# Altium project GUAU.PrjPcb
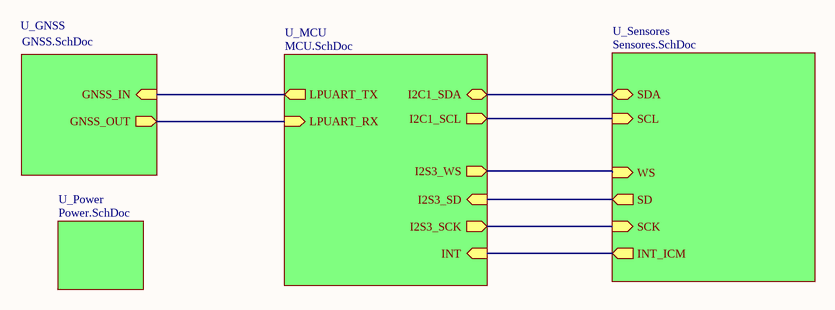
[diagram p0: Main.SchDoc]
5 sheets, 48 parts. Net scope: hierarchical (ports join the sheet entries above them; power ports are global).
Board file: GUAU.PcbDoc
Sheets:
  Main.SchDoc
    U_Power = Power.SchDoc
    U_MCU = MCU.SchDoc
    U_GNSS = GNSS.SchDoc
    U_Sensores = Sensores.SchDoc

## Sheet Main.SchDoc: GUAU
size A4; Date: *******; ApprovedBy: *******; CheckedBy: Alberte Gil; Author: *******; CompanyName: *******; DrawnBy: Mario de Miguel; Engineer: *******; Organization: *******; Address1: *******; Address2: *******; Address3: *******; Address4: *******; DocumentNumber: 1; Revision: *******; SheetNumber: 1; SheetTotal: 5; CurrentTime: *******; CurrentDate: *******; Time: *******; DocumentFullPathAndName: *******; DocumentName: *******; ModifiedDate: *******; ImagePath: *******; ProjectName: *******; Application_BuildNumber: *******

### Sub-sheets
U_GNSS = GNSS.SchDoc: GNSS_IN (in), GNSS_OUT (out)
U_MCU = MCU.SchDoc: LPUART_RX (in), LPUART_TX (out), I2C1_SDA (bidir), I2C1_SCL (out), I2S3_WS (out), I2S3_SD (in), I2S3_SCK (out), INT (in)
U_Power = Power.SchDoc: no entries
U_Sensores = Sensores.SchDoc: SDA (bidir), SCL (in), SCK (in), SD (out), INT_ICM (out), WS (in)

### Nets
SCK: sheet U_MCU/I2S3_SCK, sheet U_Sensores/SCK
SCL: sheet U_MCU/I2C1_SCL, sheet U_Sensores/SCL
SD: sheet U_MCU/I2S3_SD, sheet U_Sensores/SD
SDA: sheet U_MCU/I2C1_SDA, sheet U_Sensores/SDA
WS: sheet U_MCU/I2S3_WS, sheet U_Sensores/WS
NetU2_23: sheet U_MCU/INT, sheet U_Sensores/INT_ICM
NetU2_30: sheet U_MCU/LPUART_RX, sheet U_GNSS/GNSS_OUT
NetU2_31: sheet U_MCU/LPUART_TX, sheet U_GNSS/GNSS_IN

### Notes on the sheet
- Title:
- Drawn By:
- Page Contents:
- Checked By:
- Size:
- Date:
- File:
- License:
- Email:
- A4
- Number:
- Time:
- Revision:
- Sheet
- Website:
- of

## Sheet Power.SchDoc: Alimentación
size A4; Date: *******; ApprovedBy: *******; CheckedBy: Mario de Miguel; Author: *******; CompanyName: *******; DrawnBy: Alberte Gil; Engineer: *******; Organization: *******; Address1: *******; Address2: *******; Address3: *******; Address4: *******; DocumentNumber: 2; Revision: *******; SheetNumber: 2; SheetTotal: 5; CurrentTime: *******; CurrentDate: *******; Time: *******; DocumentFullPathAndName: *******; DocumentName: *******; ModifiedDate: *******; ImagePath: *******; ProjectName: *******; Application_BuildNumber: *******
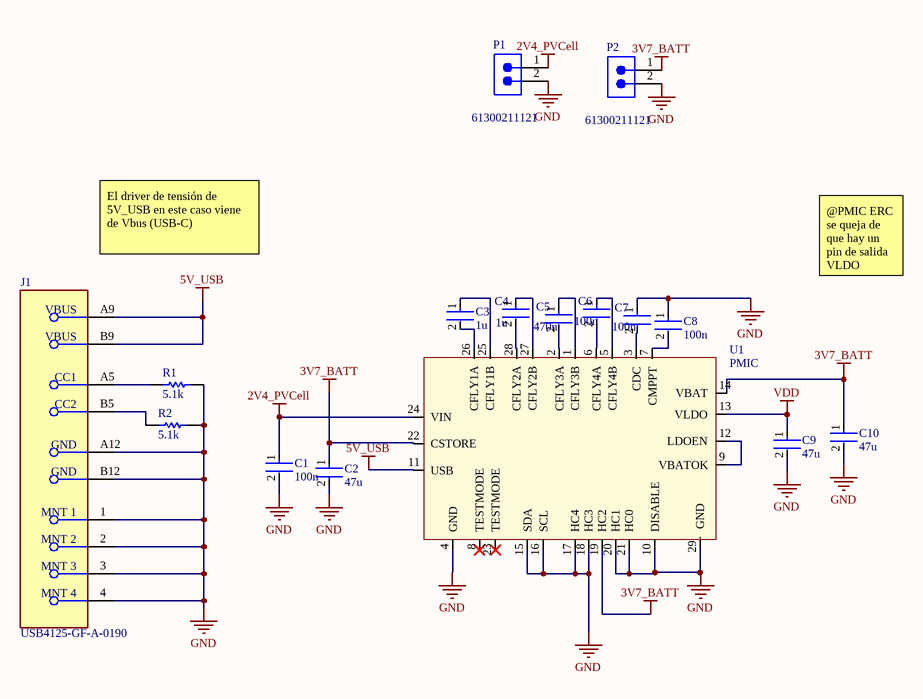
[diagram p1: Power.SchDoc]

### Parts
C1  100n  [FP-GRM033-0_03-MFG]
C2  47u  [FP-GRM188-0_2-IPC_B]
C3  1u  [FP-GRM033-0_05-e01_0_2-IPC_B]
C4  1u  [FP-GRM033-0_05-e01_0_2-IPC_B]
C5  470n  [FP-GRM033-0_03-IPC_C]
C6  100n  [FP-GRM033-0_03-MFG]
C7  100n  [FP-GRM033-0_03-MFG]
C8  100n  [FP-GRM033-0_03-MFG]
C9  47u  [FP-GRM188-0_2-IPC_B]
C10  47u  [FP-GRM188-0_2-IPC_B]
J1  USB4125-GF-A-0190  [FP-USB4125-GF-A-0190-MFG]
P1  61300211121  [61300211121]
P2  61300211121  [61300211121]
R1  5.1k  [RESC1608X55X25ML10T15]
R2  5.1k  [RESC1608X55X25ML10T15]
U1  PMIC  [HVQFN-28]

### Nets
2V4_PVCell: C1.1 P1.1 U1.24(VIN)
3V7_BATT: C2.1 C10.1 P2.1 U1.14(VBAT) U1.19(HC2) U1.22(CSTORE)
5V_USB: J1.A9(VBUS) J1.B9(VBUS) U1.11(USB)
GND: C1.2 C2.2 C7.1 C8.1 C9.2 C10.2 J1.1(MNT_1) J1.2(MNT_2) J1.3(MNT_3) J1.4(MNT_4) J1.A12(GND) J1.B12(GND) P1.2 P2.2 R1.2 R2.2 U1.4(GND) U1.10(DISABLE) U1.15(SDA) U1.16(SCL) U1.17(HC4) U1.18(HC3) U1.21(HC0) U1.29(GND)
VDD: C9.1 U1.13(VLDO)
NetC3_1: C3.1 U1.25(CFLY1B)
NetC3_2: C3.2 U1.26(CFLY1A)
NetC4_1: C4.1 U1.27(CFLY2B)
NetC4_2: C4.2 U1.28(CFLY2A)
NetC5_1: C5.1 U1.1(CFLY3B)
NetC5_2: C5.2 U1.2(CFLY3A)
NetC6_1: C6.1 U1.5(CFLY4B)
NetC6_2: C6.2 U1.6(CFLY4A)
NetC7_2: C7.2 U1.3(CDC)
NetC8_2: C8.2 U1.7(CMPPT)
NetJ1_A5: J1.A5(CC1) R1.1
NetJ1_B5: J1.B5(CC2) R2.1
NetU1_9: U1.9(VBATOK) U1.12(LDOEN)

Not connected (* = marked no-connect by the designer): U1 8(TESTMODE)* 20(HC1) 23(TESTMODE)*

### Notes on the sheet
- El driver de tensión de 5V_USB en este caso viene de Vbus (USB-C)
- @PMIC ERC se queja de que hay un pin de salida VLDO enchufado a la VDD de todo el circuito
- Title:
- Drawn By:
- Page Contents:
- Checked By:
- Size:
- Date:
- File:
- License:
- Email:
- A4
- Number:
- Time:
- Revision:
- Sheet
- Website:
- of

### Library data of the parts
C1 C6-C8 = CMP-06035-019037-1: Chip Multilayer Ceramic Capacitors for General Purpose, 0201, 0.10uF, X7S, 22%, 10%, 16V; Capacitance: 100nF; Dielectric: X7S; Tolerance: 10%; Voltage Rating (DC): 16V; Height: 0.3mm; Max Operating Temperature: 125°C; Case Code (Metric): 0603; Termination: SMD/SMT; Min Operating Temperature: -55°C; Mount: Surface Mount; Case/Package: 0201; Weight: 1.2E-05oz; Package Quantity: 15000; Length: 0.024inch; Voltage Rating: 16V; Case Code (Imperial): 0201; Packaging: Tape and Reel; Thickness: 0.013inch; Width: 0.3mm
C2 C9 C10 = CMP-2000-05444-2: Chip Multilayer Ceramic Capacitors for General Purpose, 0603, 47uF, X5R, 15%, 20%, 6.3V; Voltage Rating (DC): 6.3V; Thickness: 0.039inch; Case Code (Imperial): 0603; Packaging: Tape and Reel; Capacitance: 47uF; Width: 0.031inch; Dielectric: X5R; Max Operating Temperature: 85°C; Mount: Surface Mount; Case Code (Metric): 1608; Length: 0.063inch; Voltage Rating: 6.3V; Tolerance: 20%; Case/Package: 0603; Min Operating Temperature: -55°C
C3 C4 = CMP-06035-049033-1: Chip Multilayer Ceramic Capacitors for General Purpose, 0201, 1.0uF, X5R, 15%, 20%, 6.3V; Capacitance: 1uF; Max Operating Temperature: 85°C; Depth: 0.3mm; Case Code (Imperial): 0201; Voltage Rating (DC): 6.3V; Height: 0.3mm; Mount: Surface Mount; Weight: 1.2E-05oz; Packaging: Cut Tape; Dielectric: X5R; Width: 0.3mm; REACH SVHC: No SVHC; Package Quantity: 1; Case Code (Metric): 0603; Min Operating Temperature: -55°C; Case/Package: 0201; Tolerance: 20%; Thickness: 300um; Lead Free: Lead Free; Length: 0.6mm; Termination: SMD/SMT; Voltage: 6.3V; Voltage Rating: 6.3V
C5 = CMP-06035-010465-1: Chip Multilayer Ceramic Capacitors for General Purpose, 0201, 0.47uF, X5R, 15%, 10%, 6.3V; Capacitance: 470nF; Thickness: 0.013inch; Depth: 0.3mm; Height: 0.3mm; Mount: Surface Mount; Max Operating Temperature: 85°C; Tolerance: 10%; Dielectric: X5R; Length: 0.6mm; Package Quantity: 15000; Weight: 1.2E-05oz; Voltage Rating (DC): 6.3V; Lead Free: Lead Free; Termination: SMD/SMT; Voltage Rating: 6.3V; Case Code (Imperial): 0201; Width: 0.012inch; Case/Package: 0201; Case Code (Metric): 0603; Min Operating Temperature: -55°C; Packaging: Tape and Reel
J1 = CMP-245163-000004-1: CONN RCPT TYPE C 6P SMD RA
P1 P2 = CMP-1712-00002-6: NexarPartId: 20081794; Number of Contacts: 2; Pitch: 2.54mm; Connector Type: Male Pin; Voltage Rating: 250V; Current Rating: 3A; Gender: Male; Contact Resistance: 20mΩ; Height: 8.94mm; Lead Free: Lead Free; Number of Pins: 2; Termination: Through Hole; RoHS: Compliant; Lead Pitch: 2.54mm; REACH SVHC: No SVHC; Housing Material: PBT; Contact Mating Length: 5.9944mm; Min Operating Temperature: -40°C; Orientation: Vertical; Contact Material: Copper; Contact Gender: Male; Max Operating Temperature: 125°C; Number of Rows: 1; Number of Positions: 2; Packaging: Bulk; Contact Plating: Gold; Mount: Through Hole; Color: Black; Operating Supply Voltage: 250V
R1 R2 = CMP-2000-04091-1: Manufacturer: Yageo; Part Number: RC0603FR-075K1L
U1 = NEH7100BU: Power Management Specialised - PMIC Inductorless energy harvesting PMIC with battery protection, LDO and USB charging

## Sheet MCU.SchDoc: STM32WB05xZ
size A4; Date: *******; ApprovedBy: *******; CheckedBy: Alberte Gil; Author: *******; CompanyName: *******; DrawnBy: Mario de Miguel; Engineer: *******; Organization: *******; Address1: *******; Address2: *******; Address3: *******; Address4: *******; DocumentNumber: 3; Revision: *******; SheetNumber: 3; SheetTotal: 5; CurrentTime: *******; CurrentDate: *******; Time: *******; DocumentFullPathAndName: *******; DocumentName: *******; ModifiedDate: *******; ImagePath: *******; ProjectName: *******; Application_BuildNumber: *******
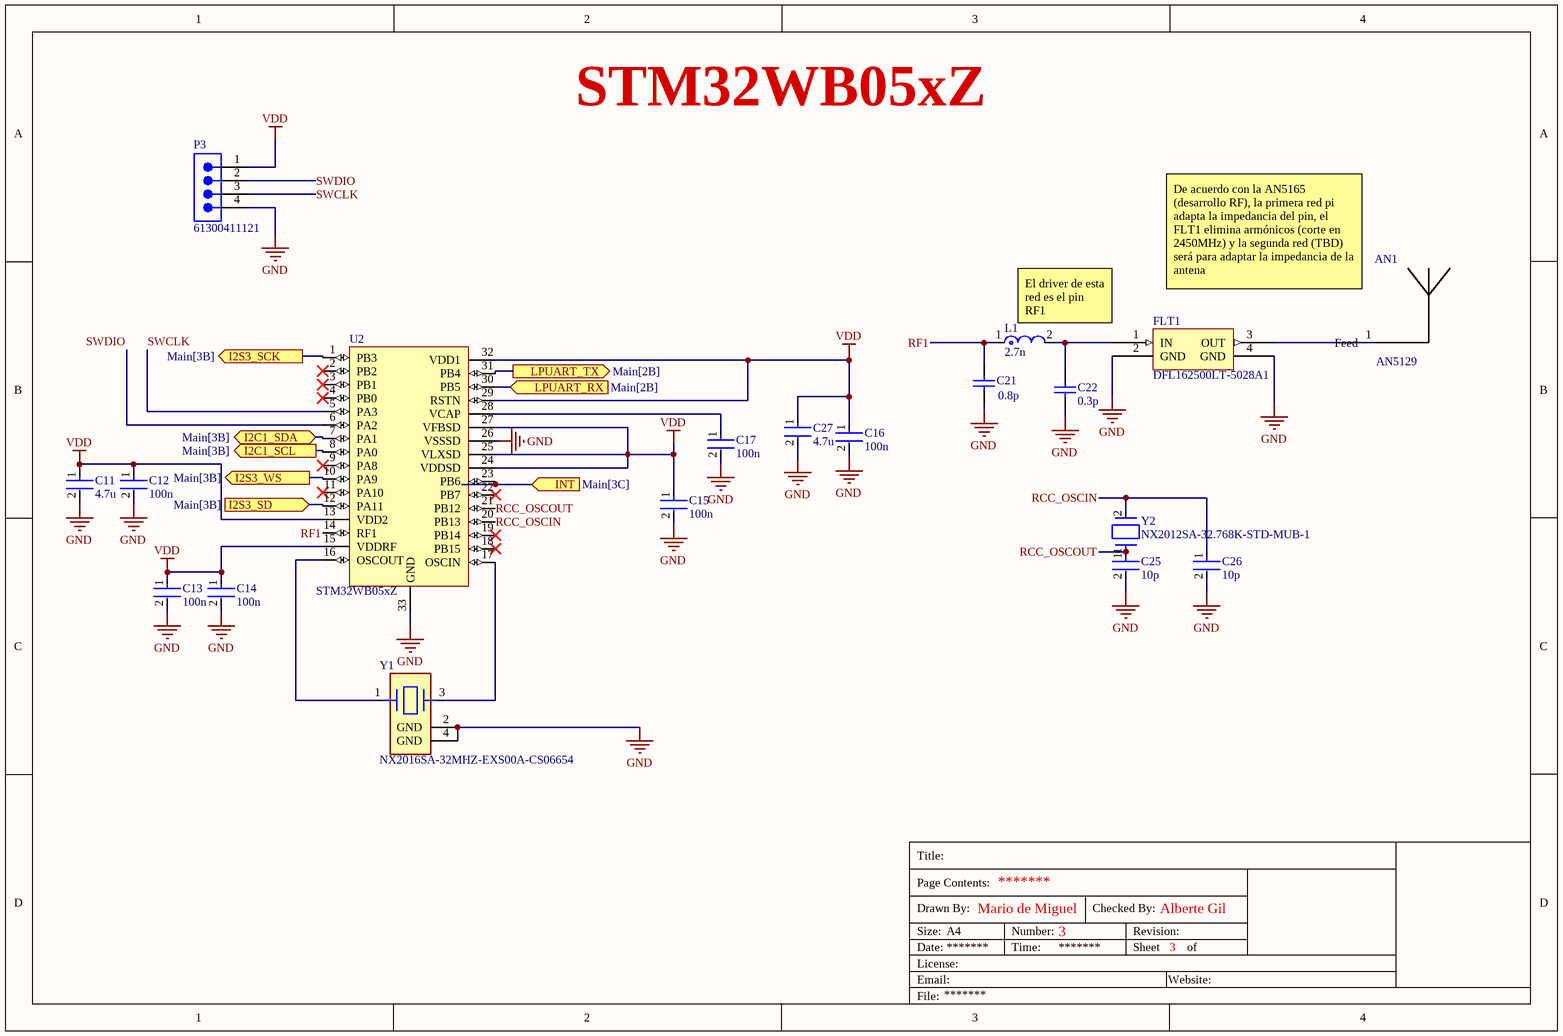
[diagram p2: MCU.SchDoc]

### Parts
AN1  AN5129  [AN5129]
C11  4.7u  [FP-GRM155-0_15-MFG]
C12  100n  [FP-GRM033-0_03-MFG]
C13  100n  [FP-GRM033-0_03-MFG]
C14  100n  [FP-GRM033-0_03-MFG]
C15  100n  [FP-GRM033-0_03-MFG]
C16  100n  [FP-GRM033-0_03-MFG]
C17  100n  [FP-GRM033-0_03-MFG]
C21  0.8p  [CAPC1005X55X25LL05T10]
C22  0.3p  [CAPC1005X55X25NL05T10]
C25  10p  [FP-GRM033-0_03-IPC_A]
C26  10p  [FP-GRM033-0_03-IPC_A]
C27  4.7u  [FP-GRM155-0_15-MFG]
FLT1  DFL162500LT-5028A1  [PCBComponent_1]
L1  2.7n  [FP-LQG15HH_02-IPC_C]
P3  61300411121  [61300411121]
U2  STM32WB05xZ  [STM32WB05XZ]
Y1  NX2016SA-32MHZ-EXS00A-CS06654  [FP-NX2016SA-MFG]
Y2  NX2012SA-32.768K-STD-MUB-1  [FP-NX2012SA-MFG]

### Ports
I2C1_SCL (out, see Main[3B]), I2C1_SDA (bidir, see Main[3B]), I2S3_SCK (out, see Main[3B]), I2S3_SD (in, see Main[3B]), I2S3_WS (out, see Main[3B]), INT (in, see Main[3C]), LPUART_RX (in, see Main[2B]), LPUART_TX (out, see Main[2B])

### Nets
GND: C11.2 C12.2 C13.2 C14.2 C15.2 C16.2 C17.2 C21.1 C22.1 C25.2 C26.2 C27.2 FLT1.2(GND) FLT1.4(GND) P3.4 U2.26(VSSSD) U2.33(GND) Y1.2(GND) Y1.4(GND)
VDD: C11.1 C12.1 C13.1 C14.1 C15.1 C16.1 C27.1 P3.1 U2.13(VDD2) U2.15(VDDRF) U2.24(VDDSD) U2.25(VLXSD) U2.27(VFBSD) U2.29(RSTN) U2.32(VDD1)
RCC_OSCIN: C26.1 U2.20(PB13) Y2.2
RCC_OSCOUT: C25.1 U2.21(PB12) Y2.1
RF1: C21.2 L1.1 U2.14(RF1)
SCK: U2.1(PB3) ; port I2S3_SCK
SCL: U2.8(PA0) ; port I2C1_SCL
SD: U2.12(PA11) ; port I2S3_SD
SDA: U2.7(PA1) ; port I2C1_SDA
SWCLK: P3.3 U2.5(PA3)
SWDIO: P3.2 U2.6(PA2)
WS: U2.10(PA9) ; port I2S3_WS
NetAN1_1: AN1.1(Feed) FLT1.3(OUT)
NetC17_1: C17.1 U2.28(VCAP)
NetC22_2: C22.2 FLT1.1(IN) L1.2
NetU2_16: U2.16(OSCOUT) Y1.1
NetU2_17: U2.17(OSCIN) Y1.3
NetU2_23: U2.23(PB6) ; port INT
NetU2_30: U2.30(PB5) ; port LPUART_RX
NetU2_31: U2.31(PB4) ; port LPUART_TX

Not connected (* = marked no-connect by the designer): U2 2(PB2)* 3(PB1)* 4(PB0)* 9(PA8)* 11(PA10)* 18(PB15)* 19(PB14)* 22(PB7)*

### Notes on the sheet
- De acuerdo con la AN5165 (desarrollo RF), la primera red pi adapta la impedancia del pin, el FLT1 elimina armónicos (corte en 2450MHz) y la segunda red (TBD) será para adaptar la impedancia de la antena
- (near L1) El driver de esta red es el pin RF1
- Title:
- Drawn By:
- Page Contents:
- Checked By:
- Size:
- Date:
- File:
- License:
- Email:
- A4
- Number:
- Time:
- Revision:
- Sheet
- Website:
- of

### Library data of the parts
C11 C27 = CMP-06035-003573-1: Chip Multilayer Ceramic Capacitors for General Purpose, 0402, 4.7uF, X5R, 15%, 20%, 10V; Case/Package: 0402; Voltage Rating: 10V; Min Operating Temperature: -55°C; Mount: Surface Mount; Packaging: Tape and Reel; Max Operating Temperature: 85°C; Capacitance: 4.7uF; Case Code (Metric): 1005; Case Code (Imperial): 0402; Tolerance: 20%
C12-C17 = CMP-06035-019037-1: as C1 on sheet Power; Dielectric: X7S; Tolerance: 10%; Voltage Rating (DC): 16V; Height: 0.3mm; Max Operating Temperature: 125°C; Case Code (Metric): 0603; Termination: SMD/SMT; Min Operating Temperature: -55°C; Mount: Surface Mount; Case/Package: 0201; Weight: 1.2E-05oz; Package Quantity: 15000; Length: 0.024inch; Voltage Rating: 16V; Case Code (Imperial): 0201; Packaging: Tape and Reel; Thickness: 0.013inch; Width: 0.3mm
C21 = CMP-1034-00043-2: Part Number: GRM1555C1HR80BA01D; Manufacturer: Murata
C22 = CMP-1034-00007-2: Part Number: GRM1555C1HR30WA01D; Manufacturer: Murata
C25 C26 = CMP-2010-01302-2: Chip Multilayer Ceramic Capacitors for General Purpose, 0201, 10pF, C0G, 30ppm/°C, 5%, 25V; Length: 0.024inch; Voltage Rating: 25V; Packaging: Tape and Reel; Max Operating Temperature: 125°C; Mount: Surface Mount; Capacitance: 10pF; Tolerance: 5%; Series: GRM; Case Code (Metric): 0603; Package Quantity: 1; Voltage Rating (DC): 25V; Depth: 0.3mm; Min Operating Temperature: -55°C; Width: 0.012inch; Thickness: 0.013inch; Termination: SMD/SMT; Lead Free: Lead Free; Case/Package: 0201; Case Code (Imperial): 0201; Dielectric: C0G; REACH SVHC: No SVHC
L1 = CMP-2000-06580-2: Multilayer type RF Inductor 2.7nH ±0.3nH 0.12Ω 800mA 0402; Max DC Current: 300mA; Q Factor: 8; Core Material: Air; Test Frequency: 100MHz; Shielding: Unshielded; Self Resonant Frequency: 6GHz; DC Resistance (DCR): 150mR; Packaging: Tape and Reel; Depth: 0.55mm; DC Current: 300mA; Length: 1mm; Current Rating: 300mA; Lead Free: Lead Free; Max Operating Temperature: 125°C; Mount: Surface Mount; Height - Seated (Max): 0.022inch; Case Code (Imperial): 0402; Height: 0.5mm; Termination: SMD/SMT; Package Quantity: 10000; Radiation Hardening: No; Width: 0.5mm; Case Code (Metric): 1005; Min Operating Temperature: -55°C; Military Standard: Not; Case/Package: 0402; Inductance: 2.7nH
P3 = CMP-1502-01064-3: NexarPartId: 32855522; Operating Supply Voltage: 250V; Pitch: 2.54mm; Contact Resistance: 20mΩ; Number of Positions: 4; Current Rating: 3A; Connector Type: Male Pin; Gender: Male; Contact Plating: Gold; Height: 8.89mm; Lead Pitch: 2.54mm; Lead Free: Lead Free; Contact Mating Length: 5.9944mm; Number of Rows: 1; Termination: Solder; Packaging: Bulk; REACH SVHC: Unknown; Min Operating Temperature: -40°C; RoHS: Compliant; Number of Contacts: 4; Voltage Rating: 250V; Color: Black; Max Operating Temperature: 105°C; Contact Material: Copper; Mount: Through Hole; Orientation: Vertical; Number of Pins: 4
Y1 = CMP-200220-000017-1: CRYSTAL 32.0000MHZ 8PF SMD; Frequency: 32MHz; ESR (Equivalent Series Resistance): 60R; Ratings: AEC-Q200; Mount: Surface Mount; Case/Package: SMD/SMT; Packaging: Tape and Reel; Load Capacitance: 8pF; Min Operating Temperature: -40°C; Max Operating Temperature: 125°C
Y2 = CMP-200220-000019-1: CRYSTAL 32.7680KHZ 12.5PF SMD; Frequency Tolerance: 20ppm; ESR (Equivalent Series Resistance): 80kR; Frequency: 32.768kHz; Mount: Surface Mount; Packaging: Cut Tape; Min Operating Temperature: -40°C; Max Operating Temperature: 85°C; Case/Package: SMD/SMT; RoHS Compliant: Yes; Length: 0.081inch; Series: NX2012SA; Height: 0.024inch; Width: 0.047inch; Load Capacitance: 12.5pF

## Sheet GNSS.SchDoc: Módulo GNSS
size A4; Date: *******; ApprovedBy: *******; CheckedBy: Alberte Gil; Author: *******; CompanyName: *******; DrawnBy: Mario de Miguel; Engineer: *******; Organization: *******; Address1: *******; Address2: *******; Address3: *******; Address4: *******; DocumentNumber: 4; Revision: *******; SheetNumber: 4; SheetTotal: 5; CurrentTime: *******; CurrentDate: *******; Time: *******; DocumentFullPathAndName: *******; DocumentName: *******; ModifiedDate: *******; ImagePath: *******; ProjectName: *******; Application_BuildNumber: *******
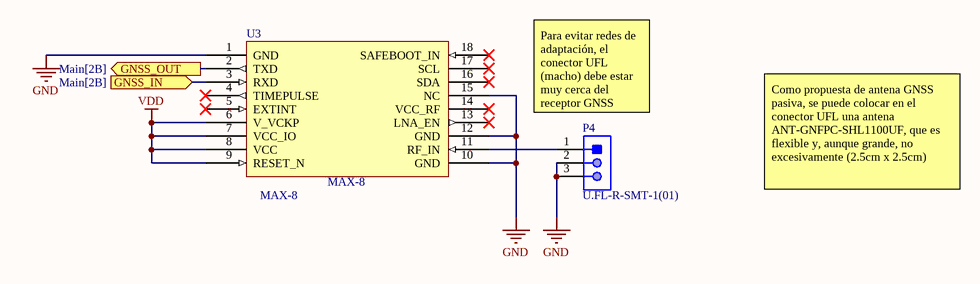
[diagram p3: GNSS.SchDoc]

### Parts
P4  U.FL-R-SMT-1(01)  [HRS-U.FL-R-SMT-3_V]
U3  MAX-8  [MAX-8 LCC18]

### Ports
GNSS_IN (in, see Main[2B]), GNSS_OUT (out, see Main[2B])

### Nets
GND: P4.2 P4.3 U3.1(GND) U3.10(GND) U3.12(GND) U3.15(NC)
VDD: U3.6(V_VCKP) U3.7(VCC_IO) U3.8(VCC) U3.9(RESET_N)
NetP4_1: P4.1 U3.11(RF_IN)
NetU2_30: U3.2(TXD) ; port GNSS_OUT
NetU2_31: U3.3(RXD) ; port GNSS_IN

Not connected (* = marked no-connect by the designer): U3 4(TIMEPULSE)* 5(EXTINT)* 13(LNA_EN)* 14(VCC_RF)* 16(SDA)* 17(SCL)* 18(SAFEBOOT_IN)*

### Notes on the sheet
- (near P4) Para evitar redes de adaptación, el conector UFL (macho) debe estar muy cerca del receptor GNSS
- Como propuesta de antena GNSS pasiva, se puede colocar en el conector UFL una antena
  ANT-GNFPC-SHL1100UF, que es flexible y, aunque grande, no excesivamente (2.5cm x 2.5cm)
- Title:
- Drawn By:
- Page Contents:
- Checked By:
- Size:
- Date:
- File:
- License:
- Email:
- A4
- Number:
- Time:
- Revision:
- Sheet
- Website:
- of

### Library data of the parts
P4 = CMP-2000-05153-1: Ultra Small Coaxial Connector, 6 GHz, -40 to 90 degC, 3-Pin SMD, RoHS, Bulk; Manufacturer: Hirose Electric; Connector Style: U.FL; Impedance: 50Ohm; Dielectric Material: LiquidCrystalPolymer(LCP); Minimum Quantity: UltraMiniatureCoaxial; Online Catalog: U.FLSeries; Featured Product: HiroseU.FLSeries; Frequency - Max: 6GHz; Other Names: H122041 / U.FL-R-SMT-1(01)-ND; Contact Termination: Solder; Body Material: PhosphorBronze; Connector Type: Jack,MalePin; Body Finish: Silver; Center Contact Plating: Gold; Manufacturer URL: https://www.hirose.com; Family: CoaxialConnectors(RF); Fastening Type: Snap-On; Unit PriceUSD: U.FL; Series: U.FL; Package Reference: U.FL-R-SMT; Packaging: Bulk; Standard Package: 100; Mounting Type: SurfaceMount; Quantity Available: Bulk; Housing Color: Silver; Package Description: 3-Pin Surface Mount Device, Body 2.6 x 2.6 mm; Category: Connectors,Interconnects; Operating Temperature: -40degC~90degC; Center Contact Material: PhosphorBronze; Dynamic Catalog: U.FLSeries; Datasheet URL: https://datasheet.ciiva.com/26945/getdatasheetpartid-475239-26945414.pdf; Datasheet Version: Feb-09; Shield Termination: Solder

## Sheet Sensores.SchDoc: Sensores
size A4; CheckedBy: Mario de Miguel; DrawnBy: Alberte Gil; SheetNumber: 5; SheetTotal: 5
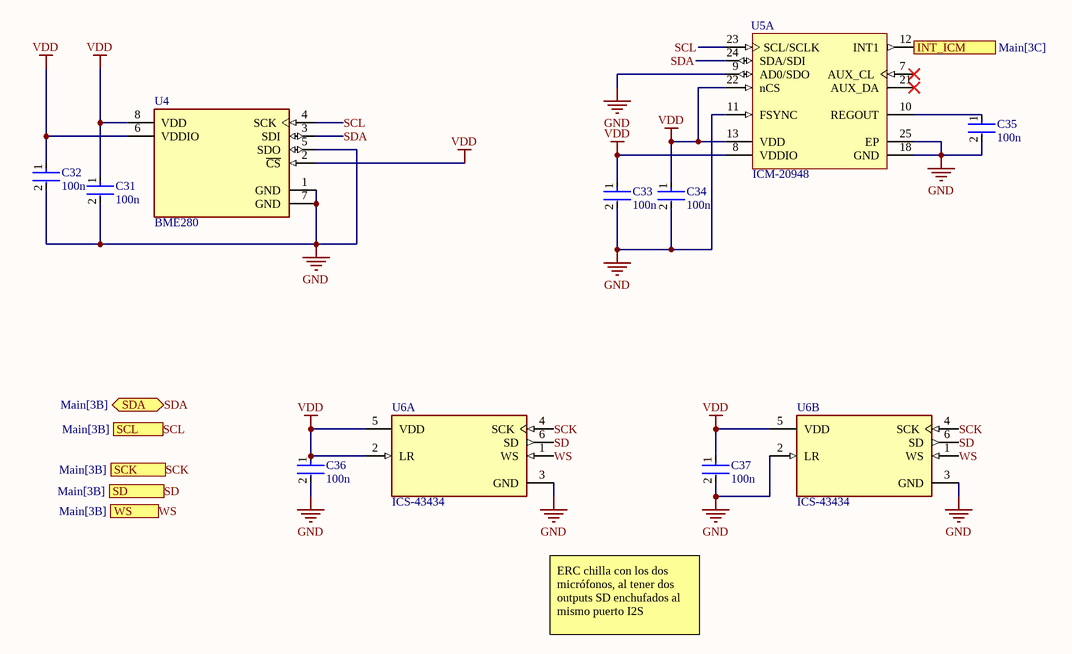
[diagram p4: Sensores.SchDoc]

### Parts
C31  100n  [FP-GRM033-0_03-MFG]
C32  100n  [FP-GRM033-0_03-MFG]
C33  100n  [FP-GRM033-0_03-MFG]
C34  100n  [FP-GRM033-0_03-MFG]
C35  100n  [FP-GRM033-0_03-MFG]
C36  100n  [FP-GRM033-0_03-MFG]
C37  100n  [FP-GRM033-0_03-MFG]
U4  BME280  [FP-BME280-MFG]
U5  ICM-20948  [TDK-QFN-24_L]  (part A of 2)
U6A  ICS-43434  [FP-ICS-43434-MFG]
U6B  ICS-43434  [FP-ICS-43434-MFG]

### Ports
INT_ICM (out, see Main[3C]), SCK (in, see Main[3B]), SCL (in, see Main[3B]), SD (out, see Main[3B]), SDA (bidir, see Main[3B]), WS (in, see Main[3B])

### Nets
GND: C31.2 C32.2 C33.2 C34.2 C35.2 C36.2 C37.2 U4.1(GND) U4.5(SDO) U4.7(GND) U5.9(AD0/SDO) U5.11(FSYNC) U5.18(GND) U5.25(EP) U6A.3(GND) U6B.2(LR) U6B.3(GND)
VDD: C31.1 C32.1 C33.1 C34.1 C36.1 C37.1 U4.2(~{CS}) U4.6(VDDIO) U4.8(VDD) U5.8(VDDIO) U5.13(VDD) U5.22(nCS) U6A.2(LR) U6A.5(VDD) U6B.5(VDD)
SCK: U6A.4(SCK) U6B.4(SCK) ; port SCK
SCL: U4.4(SCK) U5.23(SCL/SCLK) ; port SCL
SD: U6A.6(SD) U6B.6(SD) ; port SD
SDA: U4.3(SDI) U5.24(SDA/SDI) ; port SDA
WS: U6A.1(WS) U6B.1(WS) ; port WS
NetC35_1: C35.1 U5.10(REGOUT)
NetU2_23: U5.12(INT1) ; port INT_ICM

Not connected (* = marked no-connect by the designer): U5 7(AUX_CL)* 21(AUX_DA)*

### Notes on the sheet
- ERC chilla con los dos micrófonos, al tener dos outputs SD enchufados al mismo puerto I2S
- Title:
- Drawn By:
- Page Contents:
- Checked By:
- Size:
- Date:
- File:
- License:
- Email:
- A4
- Number:
- Time:
- Revision:
- Sheet
- Website:
- of

### Library data of the parts
C31-C37 = CMP-06035-019037-1: as C1 on sheet Power; Dielectric: X7S; Tolerance: 10%; Voltage Rating (DC): 16V; Height: 0.3mm; Max Operating Temperature: 125°C; Case Code (Metric): 0603; Termination: SMD/SMT; Min Operating Temperature: -55°C; Mount: Surface Mount; Case/Package: 0201; Weight: 1.2E-05oz; Package Quantity: 15000; Length: 0.024inch; Voltage Rating: 16V; Case Code (Imperial): 0201; Packaging: Tape and Reel; Thickness: 0.013inch; Width: 0.3mm
U4 = CMP-2000-05073-3: SENSOR PRESSURE HUMIDITY TEMP; Sensor Type: Temperature; Accuracy: 3%; Response Time: 1s; Output Type: SPI; Min Operating Temperature: -40°C; Max Operating Temperature: 85°C; Case/Package: LGA; Packaging: Cut Tape; Mount: Surface Mount; Lead Free: Lead Free; Number of Pins: 8
U5 = CMP-2000-07532-1: World’s Lowest Power 9-Axis MEMS MotionTracking(TM) Device, 1.71 to 3.6 V, -40 to 85 degC, 24-Pin QFN, RoHS, Tape and Reel; Manufacturer: TDK; Package Description: 24-Pin Quad Flat No-lead Package, Body 3 x 3 mm, Pitch 0.4 mm; Datasheet Version: Rev. 1.3, 06/2017; Package Reference: QFN-24; Mounting Technology: SurfaceMount; Datasheet URL: https://www.invensense.com/wp-content/uploads/2016/06/DS-000189-ICM-20948-v1.3.pdf; Manufacturer URL: http://www.tdk.com/
U6A U6B = CMP-03292-71346757-1: ICS-43434 Mic Omni-Directional -26dB 3.63V Rectangular Solder Pad T/R; Min Supply Voltage: 1.65V; Direction: Omnidirectional; Operating Supply Current: 550µA; Output Type: Digital; Max Operating Temperature: 85°C; Max Length: 3.6mm; NexarPartId: 71346757; RoHS: Compliant; Width: 2.65mm; Min Operating Temperature: -40°C; Max Supply Voltage: 3.63V; Min Length: 3.4mm; Length: 3.5mm; Min Thickness: 880µm; Lifecycle Status: Production; Min Width: 2.55mm; Max Thickness: 1.08mm; Max Width: 2.75mm; Schedule B: 8518100000; Height: 980µm

## Nets that join several sheets
GND: Power (24 pins), MCU (19 pins), GNSS (6 pins), Sensores (17 pins)
VDD: Power (C9.1 U1.13), MCU (15 pins), GNSS (U3.6 U3.7 U3.8 U3.9), Sensores (15 pins)
NetU2_23: MCU (U2.23), Sensores (U5.12)
NetU2_30: MCU (U2.30), GNSS (U3.2)
NetU2_31: MCU (U2.31), GNSS (U3.3)
SCK: MCU (U2.1), Sensores (U6A.4 U6B.4)
SCL: MCU (U2.8), Sensores (U4.4 U5.23)
SD: MCU (U2.12), Sensores (U6A.6 U6B.6)
SDA: MCU (U2.7), Sensores (U4.3 U5.24)
WS: MCU (U2.10), Sensores (U6A.1 U6B.1)